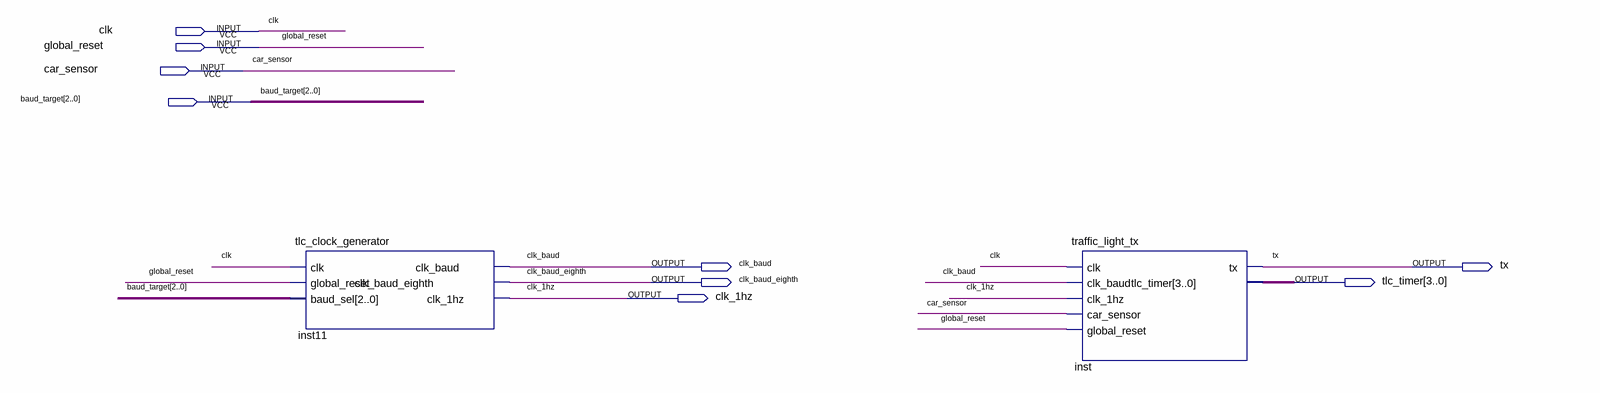
[diagram p0: schematic sheet]
// Quartus schematic uartProject.bdf as structural Verilog: 2 symbols, 9 pins
module uartProject (
  input  clk,
  input  global_reset,
  input  car_sensor,
  input  [2:0] baud_target,
  output clk_baud,
  output tx,
  output clk_baud_eighth,
  output [3:0] tlc_timer,
  output clk_1hz
);

  tlc_clock_generator inst11 (
    .clk(clk), .global_reset(global_reset), .baud_sel(baud_target), .clk_baud(clk_baud),
    .clk_baud_eighth(clk_baud_eighth), .clk_1hz(clk_1hz));
  traffic_light_tx inst (
    .clk(clk), .clk_baud(clk_baud), .clk_1hz(clk_1hz), .car_sensor(car_sensor), .global_reset(global_reset),
    .tx(tx), .tlc_timer(tlc_timer));
endmodule
